# Altium project Wacky_Racers_Vehicle.PrjPcb
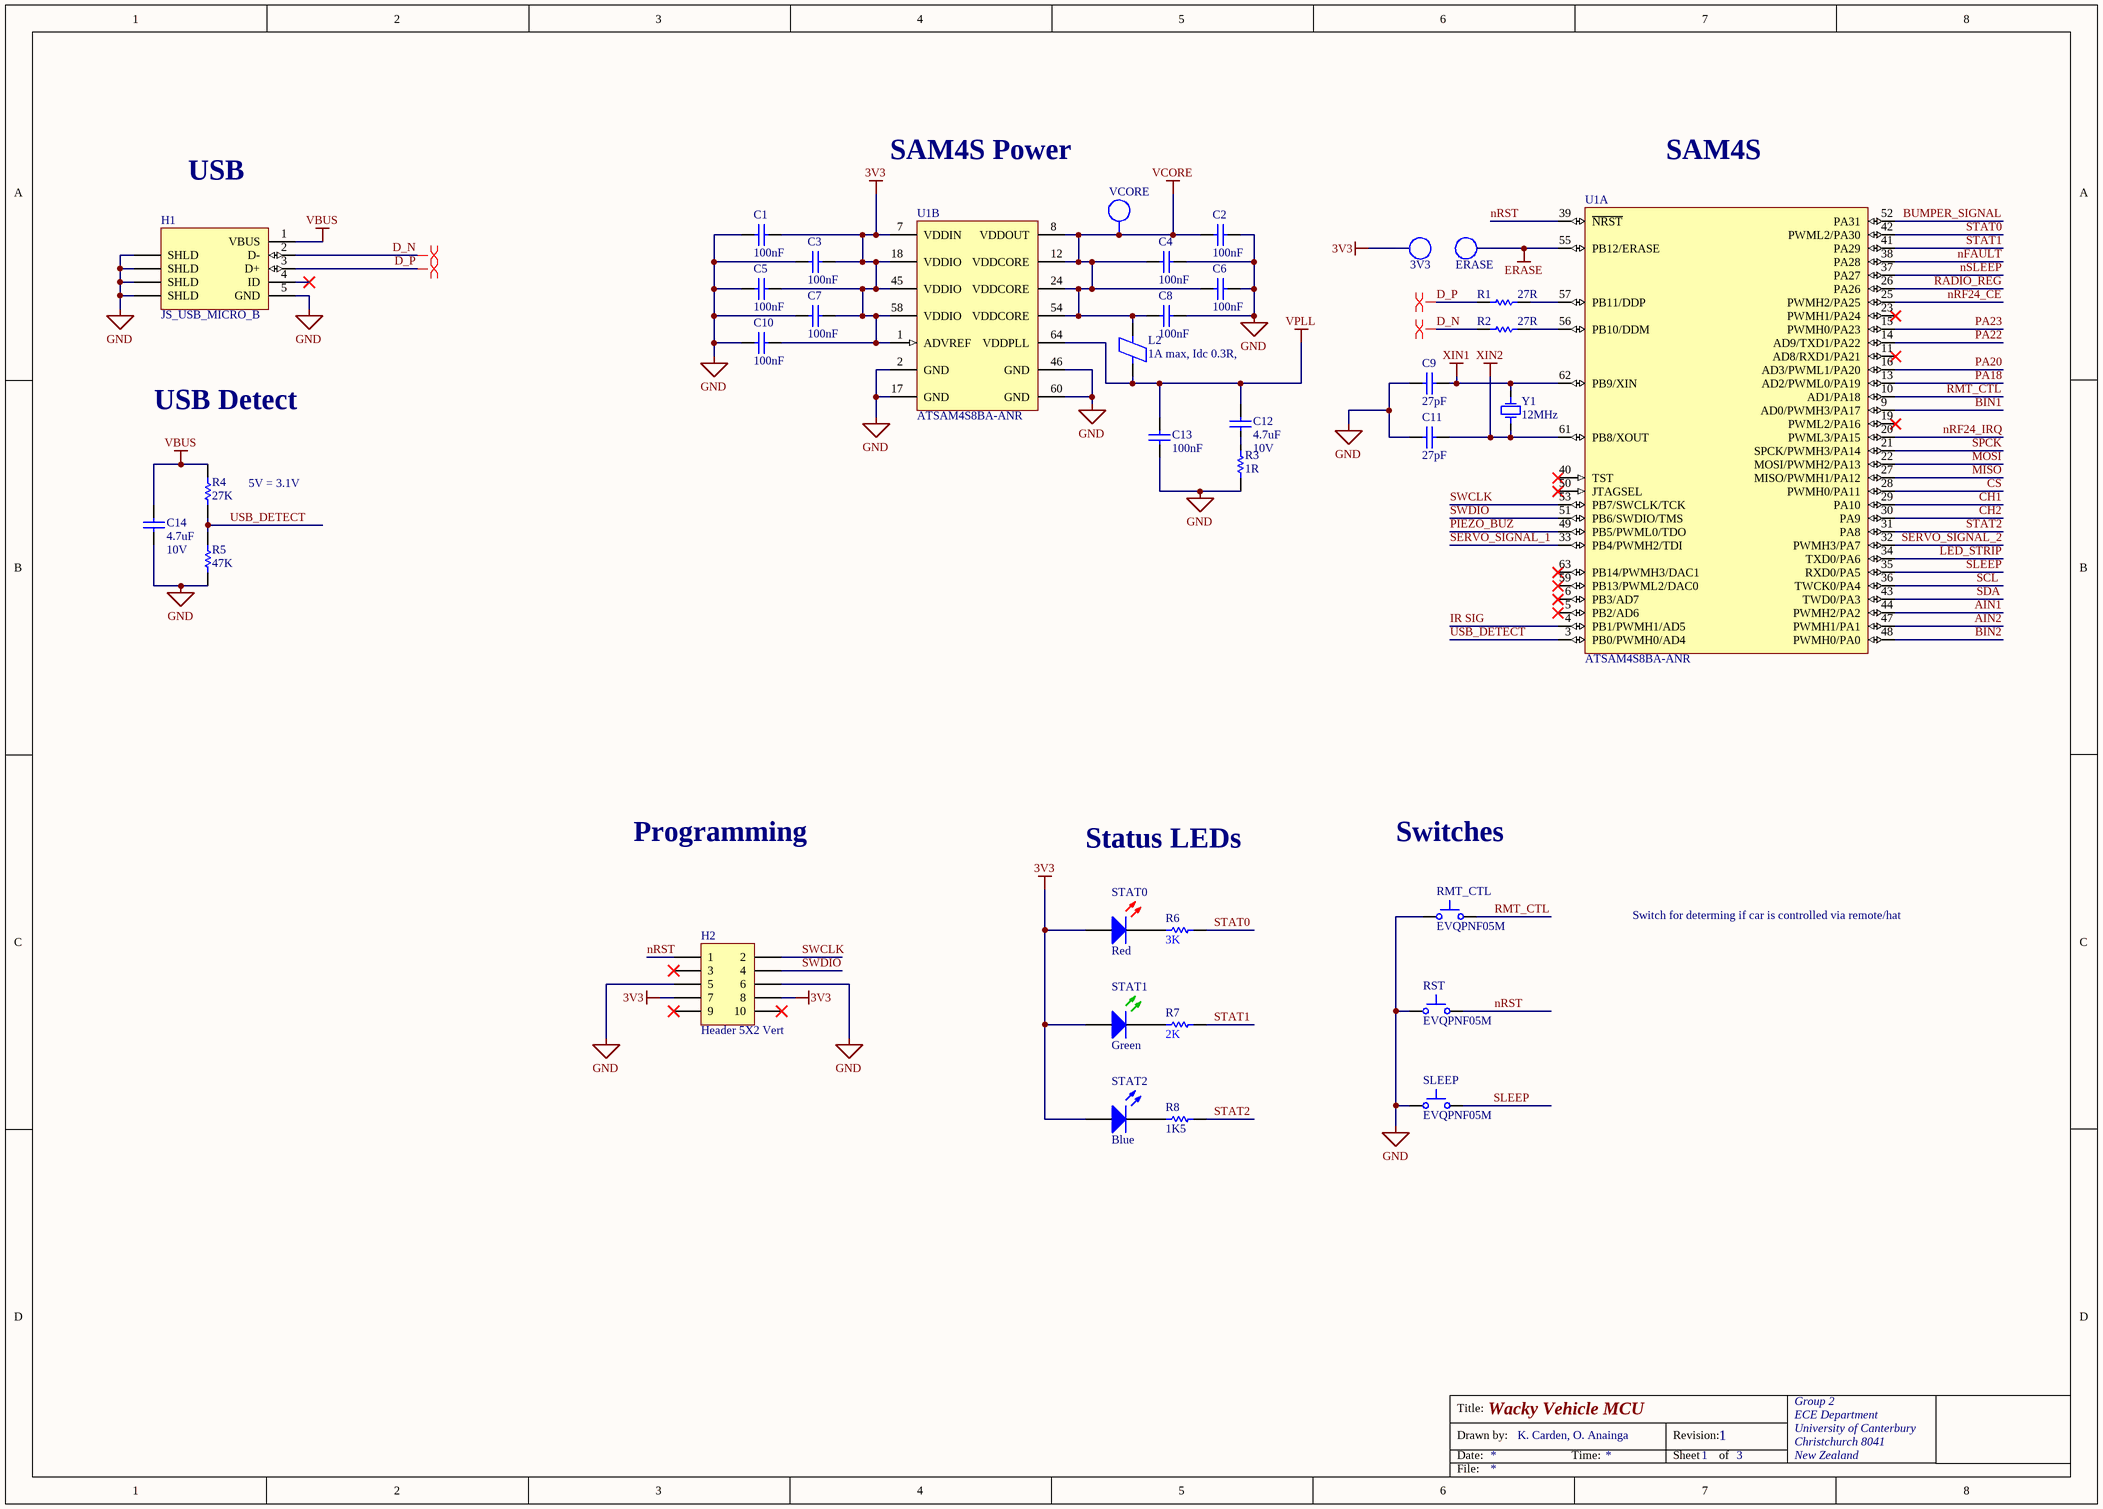
[diagram p0: Car_MCU.SchDoc]
3 sheets, 136 parts. Net scope: global (net labels, ports and power ports of the same name join across sheets).
Board file: Wacky_Car.PcbDoc
Sheets:
  Car_MCU.SchDoc
  Car_Peripherals.SchDoc
  Car_Power.SchDoc

## Sheet Car_MCU.SchDoc: Wacky Vehicle MCU
size A3; DrawnBy: K. Carden, O. Anainga; Organization: Group 2; Address1: ECE Department; Address2: University of Canterbury; Address3: Christchurch 8041; Address4: New Zealand; Revision: 1; SheetNumber: 1; SheetTotal: 3; ImagePath: C:\Users\Public\Documents\Altium\AD23\Templates\UC_Templates\uc-logo.png

### Parts
(Parts that share a designator on the sheet are numbered #1, #2 ... from top to bottom, then left to right.)
3V3#1  TP_0805  [TP_0805]  (value not drawn)
C1#1  100nF  [CAPC1608L]
C2#1  100nF  [CAPC1608L]
C3#1  100nF  [CAPC1608L]
C4#1  100nF  [CAPC1608L]
C5#1  100nF  [CAPC1608L]
C6#1  100nF  [CAPC1608L]
C7#1  100nF  [CAPC1608L]
C8#1  100nF  [CAPC1608L]
C9#1  27pF  [CAPC1608L]
C10#1  100nF  [CAPC1608L]
C11#1  27pF  [CAPC1608L]
C12#1  Max Voltage: 10V  [CAPC1608N]  (hidden comment: 4.7uF)
C13#1  100nF  [CAPC1608L]
C14#1  Max Voltage: 10V  [CAPC1608N]  (hidden comment: 4.7uF)
ERASE  TP_0805  [TP_0805]  (value not drawn)
H1  JS_USB_MICRO_B  [FCI_USB_10118194-0001LF]
H2  Header 5X2 Vert  [IDC2.54-V10D]
L2  1A max, Idc 0.3R,  [INDC3216L]
R1#1  27R  [RESC1608L]
R2#1  27R  [RESC1608L]
R3#1  1R  [RESC3216L]
R4#1  27K  [RESC1608L]
R5#1  47K  [RESC1608L]
R6  3K  [RESC1608L]
R7  2K  [RESC1608L]
R8  1K5  [RESC1608L]
RMT_CTL  EVQPNF05M  [EVQPNF05M]
RST  EVQPNF05M  [EVQPNF05M]
SLEEP  EVQPNF05M  [EVQPNF05M]
STAT0  Red  [WL-SMCW0603]
STAT1  Green  [WL-SMCW0603]
STAT2  Blue  [WL-SMCW0603]
U1#1  ATSAM4S8BA-ANR  [LQFP64_L]  (parts A,B of 2)
VCORE  VCORE  [TP_1206]  (value not drawn)  (no BOM)
Y1  12MHz  [6.0X3.5-4]

### Nets
3V3: 3V3#1.1(TP) C1#1.2 C3#1.2 C5#1.2 C7#1.2 C10#1.2 H2.7 H2.8 STAT0.2(A) STAT1.2(A) STAT2.2(A) U1#1.1(ADVREF) U1#1.7(VDDIN) U1#1.18(VDDIO) U1#1.45(VDDIO) U1#1.58(VDDIO)
ERASE: ERASE.1(TP) U1#1.55(PB12/ERASE)
GND: C1#1.1 C2#1.2 C3#1.1 C4#1.2 C5#1.1 C6#1.2 C7#1.1 C8#1.2 C9#1.1 C10#1.1 C11#1.1 C13#1.1 C14#1.1 H1.5(GND) H1.6(SHLD) H2.5 H2.6 R3#1.1 R5#1.1 RMT_CTL.1 RST.1 SLEEP.1 U1#1.2(GND) U1#1.17(GND) U1#1.46(GND) U1#1.60(GND)
VBUS: C14#1.2 H1.1(VBUS) R4#1.2
VCORE: C2#1.1 C4#1.1 C6#1.1 C8#1.1 L2.2 U1#1.8(VDDOUT) U1#1.12(VDDCORE) U1#1.24(VDDCORE) U1#1.54(VDDCORE) VCORE.1
VPLL: C12#1.2 C13#1.2 L2.1 U1#1.64(VDDPLL)
XIN1: C9#1.2 U1#1.62(PB9/XIN) Y1.3(OSC2)
XIN2: C11#1.2 U1#1.61(PB8/XOUT) Y1.1(OSC1)
AIN1: U1#1.44(PWMH2/PA2)
AIN2: U1#1.47(PWMH1/PA1)
BIN1: U1#1.9(AD0/PWMH3/PA17)
BIN2: U1#1.48(PWMH0/PA0)
BUMPER_SIGNAL: U1#1.52(PA31)
CH1: U1#1.29(PA10)
CH2: U1#1.30(PA9)
CS: U1#1.28(PWMH0/PA11)
D_N: H1.2(D-) R2#1.1
D_P: H1.3(D+) R1#1.1
IR SIG: U1#1.4(PB1/PWMH1/AD5)
LED_STRIP: U1#1.34(TXD0/PA6)
MISO: U1#1.27(MISO/PWMH1/PA12)
MOSI: U1#1.22(MOSI/PWMH2/PA13)
nFAULT: U1#1.38(PA28)
nRF24_CE: U1#1.25(PWMH2/PA25)
nRF24_IRQ: U1#1.20(PWML3/PA15)
nRST: H2.1 RST.2 U1#1.39(~{NRST})
nSLEEP: U1#1.37(PA27)
PA18: U1#1.13(AD2/PWML0/PA19)
PA20: U1#1.16(AD3/PWML1/PA20)
PA22: U1#1.14(AD9/TXD1/PA22)
PA23: U1#1.15(PWMH0/PA23)
PIEZO_BUZ: U1#1.49(PB5/PWML0/TDO)
RADIO_REG: U1#1.26(PA26)
RMT_CTL: RMT_CTL.2 U1#1.10(AD1/PA18)
SCL: U1#1.36(TWCK0/PA4)
SDA: U1#1.43(TWD0/PA3)
SERVO_SIGNAL_1: U1#1.33(PB4/PWMH2/TDI)
SERVO_SIGNAL_2: U1#1.32(PWMH3/PA7)
SLEEP: SLEEP.2 U1#1.35(RXD0/PA5)
SPCK: U1#1.21(SPCK/PWMH3/PA14)
STAT0: R6.2 U1#1.42(PWML2/PA30)
STAT1: R7.2 U1#1.41(PA29)
STAT2: R8.2 U1#1.31(PA8)
SWCLK: H2.2 U1#1.53(PB7/SWCLK/TCK)
SWDIO: H2.4 U1#1.51(PB6/SWDIO/TMS)
USB_DETECT: R4#1.1 R5#1.2 U1#1.3(PB0/PWMH0/AD4)
NetC12#1_1: C12#1.1 R3#1.2
NetR1#1_2: R1#1.2 U1#1.57(PB11/DDP)
NetR2#1_2: R2#1.2 U1#1.56(PB10/DDM)
NetR6_1: R6.1 STAT0.1(K)
NetR7_1: R7.1 STAT1.1(K)
NetR8_1: R8.1 STAT2.1(K)

Not connected (* = marked no-connect by the designer): H1 4(ID)*; H2 3* 9* 10*; U1#1 5(PB2/AD6)* 6(PB3/AD7)* 11(AD8/RXD1/PA21)* 19(PWML2/PA16)* 23(PWMH1/PA24)* 40(TST)* 50(JTAGSEL)* 59(PB13/PWML2/DAC0)* 63(PB14/PWMH3/DAC1)*

### Layout directives
differential pair: D_N, D_P

### Notes on the sheet
- USB
- SAM4S Power
- SAM4S
- USB Detect
- (near R4#1) 5V = 3.1V
- Programming
- Status LEDs
- Switches
- Switch for determing if car is controlled via remote/hat
- Title:
- Drawn by:
- Date:
- Time:
- Revision:
- Sheet
- of
- File:

### Library data of the parts
3V3#1 ERASE = TP_0805: Test Point 2.0X0.9X1.2mm SMD; Manufacturer: TE Connectivity AMP Connectors; Manufacturer Part Number: 1625854-2; Supplier 1: Digi-Key; Mounting Type: Surface Mount; Terminal: 0.079" x 0.049" x 0.057" (2.00mm x 1.25mm x 1.45mm); Type: PC Test Point; Supplier Part Number 1: A106144CT-ND
C1#1 C2#1 C3#1 C4#1 C5#1 C6#1 C7#1 C8#1 C10#1 C13#1 = CC_100nF_0603: CAP CER 100nF X7R +-10% 50V 0603; PackageReference: 0603; Code_IPC: 1608 [0603]; Verify: *; Supplier: ECE Dept; Storage Location: PCB Assembly WS; Value: 100nF
C9#1 C11#1 = CC_27pF_0603: CAP CER 27pF NPO/COG +-5% 50V 0603; PackageReference: 0603; Code_IPC: 1608 [0603]; Verify: *; Supplier: ECE Dept; Storage Location: PCB Assembly WS; Value: 27pF
C12#1 C14#1 = CC_4.7uF_0603: CAP CER 4.7uF X5R +-20%  10V 0603; Note: Footprint corresponds to dimensions for bulk cassette packaging. This case size has tightened tolerances.; PackageReference: 0805; Code_IPC: 2012[0805]; Verify: *; Supplier: ECE Dept; Storage Location: PCB Assembly WS; Value: 4.7uF
H1 = JS_USB_MICRO_B_SMT: CONN USB MICRO B RECPT SMT R/A; Manufacturer: FCI; Manufacturer Part Number: 10118194-0001LF; Gender: Receptacle; Number of Contacts: 5; Specifications: USB 2.0; Supplier 1: Digi-Key; Supplier Part Number 1: 609-4618-1-ND; Features: Shielded, Solder Retention; Mounting Type: Surface Mount, Right Angle, Horizontal
H2 = JA_HDR_IDC_5X2_VERT: IDC Header, 2,54mm, 10-Pin, Vert; Supplier: ECE Dept; Supplier 1: Farnell; Supplier Part Number 1: 1096985; Storage Location: ECE Dept Store
L2 = IN_Ferrite-Bead: Ferrite Bead, Rdc 0.3R, Z100MHZ 600R, Imax 1A, SMD 1206; Manufacturer: FAIR-RITE; Manufacturer PN: 2512066017Y1; DC Current Rating: 1; DC Resistance Max: 0.08; Ferrite Case Style: 1206 ^3216 Metric]; Frequency Range: 50MHz to 1; Impedance: 600; Impedance Tolerance: ± 25%; Supplier: ECE Dept; Storage Location: PCB Assembly WS; Ferrite Mounting: SMD; Supplier 1: Farnell; Supplier Part Number 1: 1612060; Manufacturer Part Number: 2512066017Y1; Value: 1A max, Idc 0.3R,
R1#1 R2#1 = RS_27R: RES 27 OHM 1/10W 5% 0603 SMD; Storage Location: PCB Assembly WS; Supplier: ECE Dept; Value: 27R
R3#1 = RT_1R: RES 1R OHM 1/4W 5% 1206 SMD; Storage Location: PCB Assembly WS; Supplier: ECE Dept; Value: 1R
R4#1 = RS_27K: RES 27K OHM 1/10W 5% 0603 SMD; Storage Location: PCB Assembly WS; Supplier: ECE Dept; Value: 27K
R5#1 = RS_47K: RES 47.0K OHM 1/10W 5% 0603 SMD; Storage Location: PCB Assembly WS; Supplier: ECE Dept; Value: 47K
R6 = RS_3K: RES 3K OHM 1/10W 5% 0603 SMD; Storage Location: PCB Assembly WS; Supplier: ECE Dept; Value: 3K
R7 = RS_2K: RES 2K OHM 1/10W 5% 0603 SMD; Storage Location: PCB Assembly WS; Supplier: ECE Dept; Value: 2K
R8 = RS_1K5: RES 1.5K OHM 1/10W 5% 0603 SMD; Storage Location: PCB Assembly WS; Supplier: ECE Dept; Value: 1K5
RMT_CTL RST SLEEP = WS_EVQPNF05M: Panasonic 6 x 3.5mm SMD Light Touch Switch Type SMD; PackageDescription: 6.0 x 3.5 mm; Supplier 1: Farnell; Supplier Part Number 1: 2079481; Manufacturer: Panasonic; Manufacturer PN: EVQPNF05M; Supplier 2: Digi-Key; Supplier Part Number 2: P13598SCT-ND; Storage Location: PCB Assembly WS; Supplier: ECE Dept
STAT0 = DL_150060RS75000: LED Red 250mcd 0603 SMD; Manufacturer: WURTH ELEKTRONIK; Forward Current If: 30; Forward Voltage: 2; Lens Shape: Rectangular; Luminous Intensity: 250; Wavelength Typ: 625; Viewing Angle: 140°; LED Mounting: SMD; Supplier 1: Farnell; Supplier Part Number 1: 2322071; Manufacturer Part Number: 150060RS75000; Storage Location: PCB Assembly WS; Supplier: ECE Dept; LED Colour: Red
STAT1 = DL_150060GS75000: LED Green 430mcd 0603 SMD; Manufacturer: WURTH ELEKTRONIK; Forward Current If: 30; Wavelength Typ: 520; Forward Voltage: 3.2; Lens Shape: Rectangular; Luminous Intensity: 430; Viewing Angle: 140°; LED Mounting: SMD; Supplier 1: Farnell; Supplier Part Number 1: 2322070; Manufacturer Part Number: 150060GS75000; Storage Location: PCB Assembly WS; Supplier: ECE Dept; LED Colour: Green
STAT2 = DL_150060BS75000: LED Blue 270mcd 0603 SMD; Manufacturer: WURTH ELEKTRONIK; Forward Current If: 30; Forward Voltage: 3.2; Luminous Intensity: 270; Viewing Angle: 120°; Wavelength Typ: 470; Pricing: 1=0.3844, 50=0.3252, 100=0.2957, 500=0.2365 (NZD); Supplier 1: Farnell; Supplier Part Number 1: 2322069; Manufacturer Part Number: 150060BS75000; Storage Location: PCB Assembly WS; Supplier: ECE Dept; LED Colour: Blue
U1#1 = SE_ATSAM4S16BA-MU: IC MCU 32BIT 512KB FLASH 64LQFP; Manufacturer: Atmel; Connectivity: I²C, IrDA, Memory Card, SPI, SSC, UART/USART, USB; Core Processor: ARM® Cortex®-M4; Core Size: 32-Bit; Data Converters: A/D 11x12b, D/A 2x12b; Number of I/O: 47; Peripherals: Brown-out Detect/Reset, DMA, POR, PWM, WDT; Program Memory Size: 512KB (512K x 8); RAM Size: 128K x 8; Speed: 120MHz; Voltage - Supply (Vcc/Vdd): 1.62 V ~ 3.6 V; PackageVersion: revJ, Jul-2007; PackageReference: 64PS; PackageDescription: 64-Pin Quad Flat No-Lead (QFN) Sawn, 9 x 9 x 1.0 mm Body, 0.5 mm Pitch, Exposed Pad; Code_JEDEC: MO-220VMMD-3; ComponentLink1Description: Manufacturer URL; ComponentLink1URL: http://www.atmel.com/; ComponentLink2Description: SAM4S Series Datasheet; ComponentLink2URL: http://www.atmel.com/dyn/resources/prod_documents/11100.pdf; ComponentLink3Description: SAM4S Series Summary; ComponentLink3URL: http://www.atmel.com/dyn/resources/prod_documents/11100S.pdf; Supplier 1: Digi-Key; Package / Case: 64-LQFP; Packaging: Cut Tape (CT); Program Memory Type: FLASH; Supplier Part Number 1: ATSAM4S8BA-ANRCT-ND; Manufacturer Part Number: ATSAM4S8BA-ANR
VCORE = TP_1206: Test-Point 3.3x1.6x2.1mm SMD; Manufacturer: Harwin Inc; Manufacturer Part Number: S1751-46R; Value: TP; Manufacturer PN: *; Storage Location: ProtoPlace; Mounting Type: Surface Mount; Type: PC Test Point; Supplier 1: Digi-Key; Supplier Part Number 1: 952-1478-2-ND; Supplier 2: Farnell; Supplier Part Number 2: 1826282; Supplier: ECE Dept
Y1 = XT_CRYSTAL_12MHz_18pF: CRYSTAL 12MHZ 18PF 6X3.5mm SMD; Manufacturer: CTS-Frequency Controls; Manufacturer Part Number: 406C35D12M00000; ESR (Equivalent Series Resistance): 60 Ohm; Frequency Stability: ±50ppm; Frequency Tolerance: ±30ppm; Operating Mode: Fundamental; Supplier 1: Digi-Key; Height: 0.047" (1.20mm); Load Capacitance: 18pF; Mounting Type: Surface Mount; Operating Temperature: -20°C ~ 70°C; Package / Case: 4-SMD, No Lead (DFN, LCC); Size / Dimension: 0.236" L x 0.138" W (6.00mm x 3.50mm); Supplier Part Number 1: CTX855CT-ND; Frequency: 12MHz

## Sheet Car_Peripherals.SchDoc: Wacky Vehicle Peripherals
size A3; DrawnBy: K. Carden, O. Anainga; Organization: Group 2; Address1: ECE Department; Address2: University of Canterbury; Address3: Christchurch 8041; Address4: New Zealand; Revision: 1; SheetNumber: 2; SheetTotal: 3; ImagePath: C:\Users\Public\Documents\Altium\AD23\Templates\UC_Templates\uc-logo.png
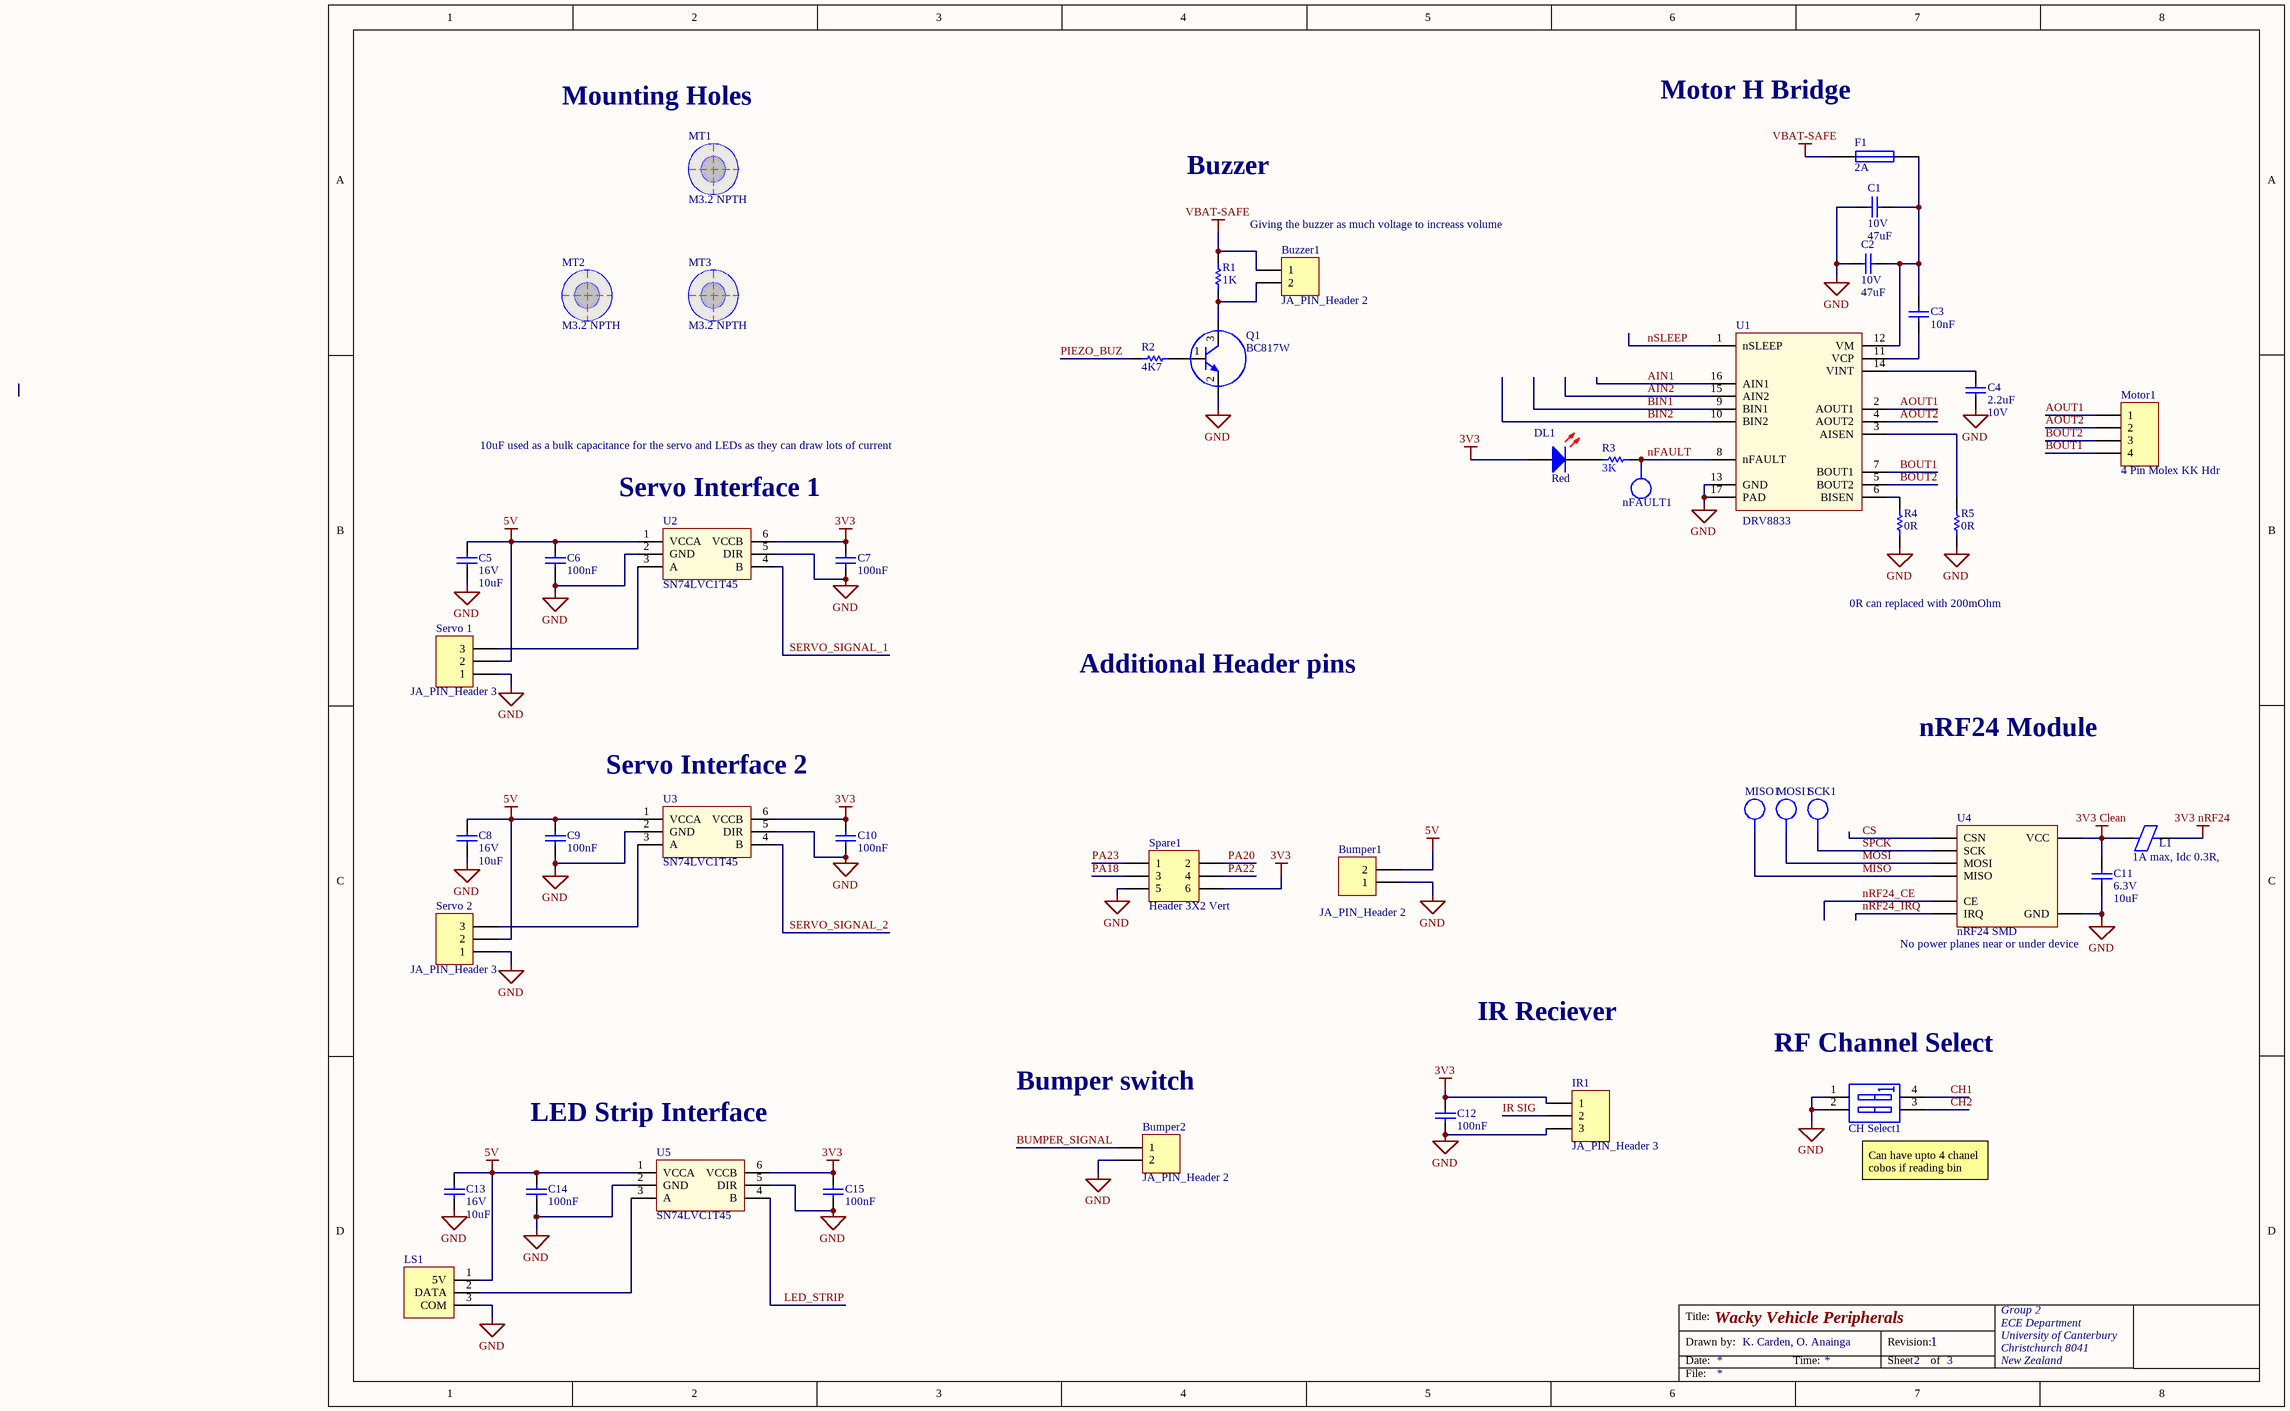
[diagram p1: Car_Peripherals.SchDoc]

### Parts
(Parts that share a designator on the sheet are numbered #1, #2 ... from top to bottom, then left to right.)
Bumper1  JA_PIN_Header 2  [HDR1X2]
Bumper2  JA_PIN_Header 2  [HDR1X2]
Buzzer1  JA_PIN_Header 2  [HDR1X2]
C1#2  Max Voltage: 10V  [CAPC3216L]  (hidden comment: 47uF)
C2#2  Max Voltage: 10V  [CAPC3216L]  (hidden comment: 47uF)
C3#2  10nF  [CAPC1608L]
C4#2  Max Voltage: 10V  [CAPC1608L]  (hidden comment: 2.2uF)
C5#2  Voltage - Rated: 16V  [CAPC2012L]  (hidden comment: 10uF)
C6#2  100nF  [CAPC1608L]
C7#2  100nF  [CAPC1608L]
C8#2  Voltage - Rated: 16V  [CAPC2012L]  (hidden comment: 10uF)
C9#2  100nF  [CAPC1608L]
C10#2  100nF  [CAPC1608L]
C11#2  Voltage - Rated: 6.3V  [CAPC1608L]  (hidden comment: 10uF)
C12#2  100nF  [CAPC1608L]
C13#2  Voltage - Rated: 16V  [CAPC2012L]  (hidden comment: 10uF)
C14#2  100nF  [CAPC1608L]
C15  100nF  [CAPC1608L]
CH_Select1  WS_SW DIP-2  [DIP_SW_2WAY_SMD]  (value not drawn)
DL1  Red  [WL-SMCW0603]
F1  2A  [RESC3216N]
IR1  JA_PIN_Header 3  [HDR1X3]
L1  1A max, Idc 0.3R,  [INDC3216L]
LS1  3 Pin Molex KK Hdr  [MOLEX_KK_3_HDR]  (value not drawn)
MISO1  (no value)  [TP_1206]  (no BOM)
MOSI1  (no value)  [TP_1206]  (no BOM)
Motor1  4 Pin Molex KK Hdr  [MOLEX_KK_4_HDR]
MT1  M3.2 NPTH  [MNT-HOLE_3.2mm_NPTH]  (no BOM)
MT2  M3.2 NPTH  [MNT-HOLE_3.2mm_NPTH]  (no BOM)
MT3  M3.2 NPTH  [MNT-HOLE_3.2mm_NPTH]  (no BOM)
nFAULT1  (no value)  [TP_1206]  (no BOM)
Q1  BC817W  [SOT323_M]
R1#2  1K  [RESC1608L]
R2#2  4K7  [RESC1608L]
R3#2  3K  [RESC1608L]
R4#2  0R  [RESC3216L]
R5#2  0R  [RESC3216L]
SCK1  (no value)  [TP_1206]  (no BOM)
Servo_1  JA_PIN_Header 3  [HDR1X3]
Servo_2  JA_PIN_Header 3  [HDR1X3]
Spare1  Header 3X2 Vert  [IDC2.54-V06D]
U1#2  DRV8833  [HTSOP16 DRV8833]
U2  SN74LVC1T45  [SOT23-6_N]
U3  SN74LVC1T45  [SOT23-6_N]
U4  nRF24 SMD  Warning: No power planes near or under device  [NRF24]
U5  SN74LVC1T45  [SOT23-6_N]

### Nets
3V3: C7#2.2 C10#2.2 C12#2.2 C15.2 DL1.2(A) IR1.1 Spare1.6 U2.6(VCCB) U3.6(VCCB) U5.6(VCCB)
3V3 Clean: C11#2.2 L1.2 U4.1(VCC)
3V3 nRF24: L1.1
5V: Bumper1.2 C5#2.2 C6#2.2 C8#2.2 C9#2.2 C13#2.2 C14#2.2 LS1.1(5V) Servo_1.2 Servo_2.2 U2.1(VCCA) U3.1(VCCA) U5.1(VCCA)
GND: Bumper1.1 Bumper2.2 C1#2.2 C2#2.2 C4#2.1 C5#2.1 C6#2.1 C7#2.1 C8#2.1 C9#2.1 C10#2.1 C11#2.1 C12#2.1 C13#2.1 C14#2.1 C15.1 CH_Select1.1(A1) CH_Select1.2(A2) IR1.3 LS1.3(COM) Q1.2 R4#2.1 R5#2.1 Servo_1.1 Servo_2.1 Spare1.5 U1#2.13(GND) U1#2.17(PAD) U2.2(GND) U2.5(DIR) U3.2(GND) U3.5(DIR) U4.2(GND) U5.2(GND) U5.5(DIR)
VBAT-SAFE: Buzzer1.1 F1.1 R1#2.2
AIN1: U1#2.16(AIN1)
AIN2: U1#2.15(AIN2)
AOUT1: Motor1.1 U1#2.2(AOUT1)
AOUT2: Motor1.2 U1#2.4(AOUT2)
BIN1: U1#2.9(BIN1)
BIN2: U1#2.10(BIN2)
BOUT1: Motor1.4 U1#2.7(BOUT1)
BOUT2: Motor1.3 U1#2.5(BOUT2)
BUMPER_SIGNAL: Bumper2.1
CH1: CH_Select1.4(B1)
CH2: CH_Select1.3(B2)
CS: U4.4(CSN)
IR SIG: IR1.2
LED_STRIP: U5.4(B)
MISO: MISO1.1 U4.7(MISO)
MOSI: MOSI1.1 U4.6(MOSI)
nFAULT: nFAULT1.1 R3#2.2 U1#2.8(nFAULT)
nRF24_CE: U4.3(CE)
nRF24_IRQ: U4.8(IRQ)
nSLEEP: U1#2.1(nSLEEP)
PA18: Spare1.3
PA20: Spare1.2
PA22: Spare1.4
PA23: Spare1.1
PIEZO_BUZ: R2#2.1
SERVO_SIGNAL_1: U2.4(B)
SERVO_SIGNAL_2: U3.4(B)
SPCK: SCK1.1 U4.5(SCK)
NetBuzzer1_2: Buzzer1.2 Q1.3 R1#2.1
NetC1#2_1: C1#2.1 C2#2.1 C3#2.2 F1.2 U1#2.12(VM)
NetC3#2_1: C3#2.1 U1#2.11(VCP)
NetC4#2_2: C4#2.2 U1#2.14(VINT)
NetDL1_1: DL1.1(K) R3#2.1
NetLS1_2: LS1.2(DATA) U5.3(A)
NetQ1_1: Q1.1 R2#2.2
NetR4#2_2: R4#2.2 U1#2.6(BISEN)
NetR5#2_2: R5#2.2 U1#2.3(AISEN)
NetServo_1_3: Servo_1.3 U2.3(A)
NetServo_2_3: Servo_2.3 U3.3(A)

### Notes on the sheet
- Motor H Bridge
- Mounting Holes
- Buzzer
- Giving the buzzer as much voltage to increass volume
- 10uF used as a bulk capacitance for the servo and LEDs as they can draw lots of current
- Servo Interface 1
- 0R can replaced with 200mOhm
- Additional Header pins
- Servo Interface 2
- nRF24 Module
- IR Reciever
- (near CH_Select1) RF Channel Select
- Bumper switch
- LED Strip Interface
- (near CH_Select1) Can have upto 4 chanel cobos if reading bin
- Title:
- Drawn by:
- Date:
- Time:
- Revision:
- Sheet
- of
- File:

### Library data of the parts
Bumper1 Bumper2 Buzzer1 = JA_PIN_Header 2: Header, 2-Pin; LatestRevisionDate: 17-Jul-2002; LatestRevisionNote: Re-released for DXP Platform.; Publisher: Altium Limited
C1#2 C2#2 = CC_47uF_1206: CAP CER 47uF X5R -/+20% 10V 1206; Verify: *; Supplier: ECE Dept; Storage Location: PCB Assembly WS; Dielectric: X5R; Footprint: 1210 (3225 metric); MoV: 10V; Value: 47uF
C3#2 = CC_10nF_0603: CAP CER 10nF X7R +-10% 50V 0603; PackageReference: 0603; Code_IPC: 1608 [0603]; Verify: *; Supplier: ECE Dept; Storage Location: PCB Assembly WS; Value: 10nF
C4#2 = CC_2.2uF_0603: CAP CER 2.2uF X5R +-20% 10V 0603; PackageReference: 0603; Code_IPC: 1608 [0603]; Verify: *; Supplier: ECE Dept; Storage Location: PCB Assembly WS; Value: 2.2uF
C5#2 C8#2 C13#2 = CC_10uF_0805_16V: CAP CER 10uF X5R 16V 0805; Manufacturer: Samsung Electro-Mechanics; Manufacturer Part Number: CL21A106KOQNNWE; Note: Footprint corresponds to dimensions for bulk cassette packaging. This case size has tightened tolerances.; Tolerance: ±10%; Notification: Current market demand for these product types have resulted in fluctuating and extending lead times. Lead times may differ.; PackageReference: 0805; Code_IPC: 2012[0805]; Supplier 1: Digi-Key; RoHS: RoHS Compliant; Category: Capacitors; Stock 1: 20000; Pricing 1: 1=0.35, 10=0.25, 100=0.1178, 500=0.08254, 1000=0.06831 (NZD); Packaging: Cut Tape (CT); Part Status: Active; Temperature Coefficient: X5R; Operating Temperature: -55°C ~ 85°C; Features: -; Ratings: -; Applications: General Purpose; Mounting Type: Surface Mount, MLCC; Package / Case: 0805 (2012 Metric); Size / Dimension: 0.079" L x 0.049" W (2.00mm x 1.25mm); Height - Seated (Max): -; Thickness (Max): 0.055" (1.40mm); Lead Spacing: -; Lead Style: -; ComponentLink1URL: http://www.samsungsem.com/kr/support/product-search/mlcc/CL21A106KOQNNWE.jsp; ComponentLink1Description: http://www.samsungsem.com/kr/support/product-search/mlcc/CL21A106KOQNNWE.jsp; Supplier Part Number 1: 1276-2894-1-ND; Value: 10uF
C6#2 C7#2 C9#2 C10#2 C12#2 C14#2 C15 = CC_100nF_0603: CAP CER 100nF X7R +-10% 50V 0603; PackageReference: 0603; Code_IPC: 1608 [0603]; Verify: *; Supplier: ECE Dept; Storage Location: PCB Assembly WS; Value: 100nF
C11#2 = CC_10uF_0603: CAP CER 10UF X5R +-20% 6V3 0603; Supplier: ECE Dept; Storage Location: PCB Assembly WS; Value: 10uF
CH_Select1 = WS_SW DIP-2: DIP Switch, 2 Position, SPST SMD; Manufacturer: OMRON ELECTRONIC COMPONENTS; Manufacturer Part Number: A6SN-2101; Contact Current DC Max: 25; External Length / Height: 7; No. of Switch Positions: 2; Pitch Spacing: 2.54; PackageReference: DIP-4; Contact Configuration: SPST; Supplier 1: Farnell; Supplier Part Number 1: 2029424; Storage Location: PCB Assembly WS; Supplier: ECE Dept
DL1 = DL_150060RS75000: as STAT0 on sheet Car_MCU; LED Mounting: SMD; Supplier 1: Farnell; Supplier Part Number 1: 2322071; Manufacturer Part Number: 150060RS75000; Storage Location: PCB Assembly WS; Supplier: ECE Dept; LED Colour: Red
F1 = FS_Fuse_2.0A: Fuse 2.0A Very Fast Acting 1206 SMD; Manufacturer: MULTICOMP; Manufacturer PN: MC12CF 002; Supplier: ECE Dept; Storage Location: PCB Assembly WS; Supplier 1: Farnell; Supplier Part Number 1: 1841029; Manufacturer Part Number: MC12CF 002; Value: 2A
IR1 Servo_1 Servo_2 = JA_PIN_Header 3: Header, 3-Pin; LatestRevisionDate: 17-Jul-2002; LatestRevisionNote: Re-released for DXP Platform.; Publisher: Altium Limited
L1 = IN_Ferrite-Bead: as L2 on sheet Car_MCU; Supplier: ECE Dept; Storage Location: PCB Assembly WS; Ferrite Mounting: SMD; Supplier 1: Farnell; Supplier Part Number 1: 1612060; Manufacturer Part Number: 2512066017Y1; Value: 1A max, Idc 0.3R,
LS1 = LED_Strip_Header: CONN HEADER 3POS 2.54mm VERT_Thru Hole; Manufacturer: Molex; Manufacturer PN: 22-23-2031; Supplier Part Number 1: 9731156; Supplier: ECE Dept; Supplier 1: Farnell; Storage Location: ECE Dept Store; Value: 3 Pin Molex KK Hdr
MISO1 MOSI1 nFAULT1 SCK1 = TP_1206: as VCORE on sheet Car_MCU; Manufacturer PN: *; Storage Location: ProtoPlace; Mounting Type: Surface Mount; Type: PC Test Point; Supplier 1: Digi-Key; Supplier Part Number 1: 952-1478-2-ND; Supplier 2: Farnell; Supplier Part Number 2: 1826282; Supplier: ECE Dept
Motor1 = JA_MOLEX_KK_4POS: CONN HEADER 4POS 2.54mm VERT_Thru Hole; Manufacturer: Molex; Manufacturer PN: 22-23-2041; Supplier Part Number 1: 9731164; Supplier: ECE Dept; Supplier 1: Farnell; Storage Location: ECE Dept Store; Value: 4 Pin Molex KK Hdr
MT1-MT3 = MC_M3.2_HOLE: Fixing M3.2 Mount Hole NPTH; Manufacturer: Hi-Q; Manufacturer PN: 3BV series M3 Clearance; price: 0; Supplier: ECE Dept; value: M3.2 NPTH
Q1 = TB_BC817W: NPN GP Bipolar Transistor 45V 500mA SOT323; Manufacturer: NXP; Supplier 1: Farnell; Supplier Part Number 1: 2114873; Manufacturer PN: BC817W; Storage Location: PCB Assembly WS; Supplier: ECE Dept; Supplier 2: Digi-Key; Value: BC817W; Supplier Part Number 2: 1727-4843-1-ND
R1#2 = RS_1K: RES 1.0K OHM 1/10W 5% 0603 SMD; Storage Location: PCB Assembly WS; Supplier: ECE Dept; Value: 1K
R2#2 = RS_4K7: RES 4.7K OHM 1/10W 5% 0603 SMD; Storage Location: PCB Assembly WS; Supplier: ECE Dept; Value: 4K7
R3#2 = RS_3K: RES 3K OHM 1/10W 5% 0603 SMD; Storage Location: PCB Assembly WS; Supplier: ECE Dept; Value: 3K
R4#2 R5#2 = RT_0R: RES 0R OHM 1/8W 5% 1206 SMD; Storage Location: PCB Assembly WS; Supplier: ECE Dept; Value: 0R
Spare1 = JA_HDR_IDC_3X2_VERT: IDC Header, 2,54mm, 6-Pin, Vert; Manufacturer: Amphenol FCI; Manufacturer Part Number: 75869-131LF; Number of Positions: 6; Max Voltage Rating (AC): 500V; Connector Type: Male Pin; Current Rating: 3A; Gender: Male; Max Current Rating: 2A; Pitch: 2.54mm; Row Spacing: 0.1inch; Mating Post Length: 6mm; Supplier: ECE Dept; Storage Location: ECE Dept Store; Supplier 1: Digi-Key; Supplier 2: Element14; Stock 1: 21632; Pricing 1: 1=0.74, 10=0.697, 100=0.5345, 500=0.4648, 1000=0.38346, 5000=0.33698, 10000=0.31374 (USD); Mount: Through Hole; Contact Plating: Gold,GXT; Contact Material: Bronze,Copper Alloy; Colour: Blue; Housing Colour: Blue; Housing Material: Thermoplastic; Min Operating Temperature: -65°C; Max Operating Temperature: 125°C; Number of Rows: 2; Packaging: Rail/Tube; Package Quantity: 100; Termination: Solder; Number of Contacts: 6; Orientation: Straight; Contact Gender: Male; Voltage Rating: 500V; Length: 14.83mm; Height: 27.2mm; Depth: 9.55mm; Termination Post Length: 3.05mm; Contact Mating Length: 0.236inch; Radiation Hardening: No; Lead Free: Lead Free; REACH SVHC: No SVHC; ComponentLink1URL: https://datasheet.ciiva.com/16656/75869-16656678.pdf; ComponentLink1Description: https://datasheet.ciiva.com/16656/75869-16656678.pdf; ComponentLink2URL: https://datasheet.ciiva.com/5722/75869-5722919.pdf; ComponentLink2Description: https://datasheet.ciiva.com/5722/75869-5722919.pdf; ComponentLink3URL: https://datasheet.ciiva.com/9465/75869-9465975.pdf; ComponentLink3Description: https://datasheet.ciiva.com/9465/75869-9465975.pdf; ComponentLink4URL: https://datasheet.ciiva.com/11748/0900766b80d79252-11748151.pdf; ComponentLink4Description: https://datasheet.ciiva.com/11748/0900766b80d79252-11748151.pdf; ComponentLink5URL: https://datasheet.ciiva.com/719/75869-719692.pdf; ComponentLink5Description: https://datasheet.ciiva.com/719/75869-719692.pdf; ComponentLink6URL: https://datasheet.ciiva.com/8046/75869-8046653.pdf; ComponentLink6Description: https://datasheet.ciiva.com/8046/75869-8046653.pdf; ComponentLink7URL: https://datasheet.ciiva.com/22644/1688107-22644798.pdf; ComponentLink7Description: https://datasheet.ciiva.com/22644/1688107-22644798.pdf; Supplier Part Number 1: 609-2845-ND; Supplier Part Number 2: 2293757
U1#2 = DRV8833: Dual H-Bridge Motor Driver 1.5A; ComponentLink1Description: DRV8833 Datasheet; ComponentLink1URL: \\maxwell\elecapp\AltiumDesigner\Libraries\DatasheetsNew\ENCE461\drv8833pwpr.pdf
U2 U3 U5 = SN74LVC1T45: 1.8V - 5V level converter
U4 = NRF24: nRF24 SMD Module

## Sheet Car_Power.SchDoc: Wacky Vehicle Power
size A3; DrawnBy: K. Carden, O. Anainga, Liam May; Organization: Group 2; Address1: ECE Department; Address2: University of Canterbury; Address3: Christchurch 8041; Address4: New Zealand; Revision: 1; SheetNumber: 3; SheetTotal: 3; ImagePath: C:\Users\Public\Documents\Altium\AD23\Templates\UC_Templates\uc-logo.png
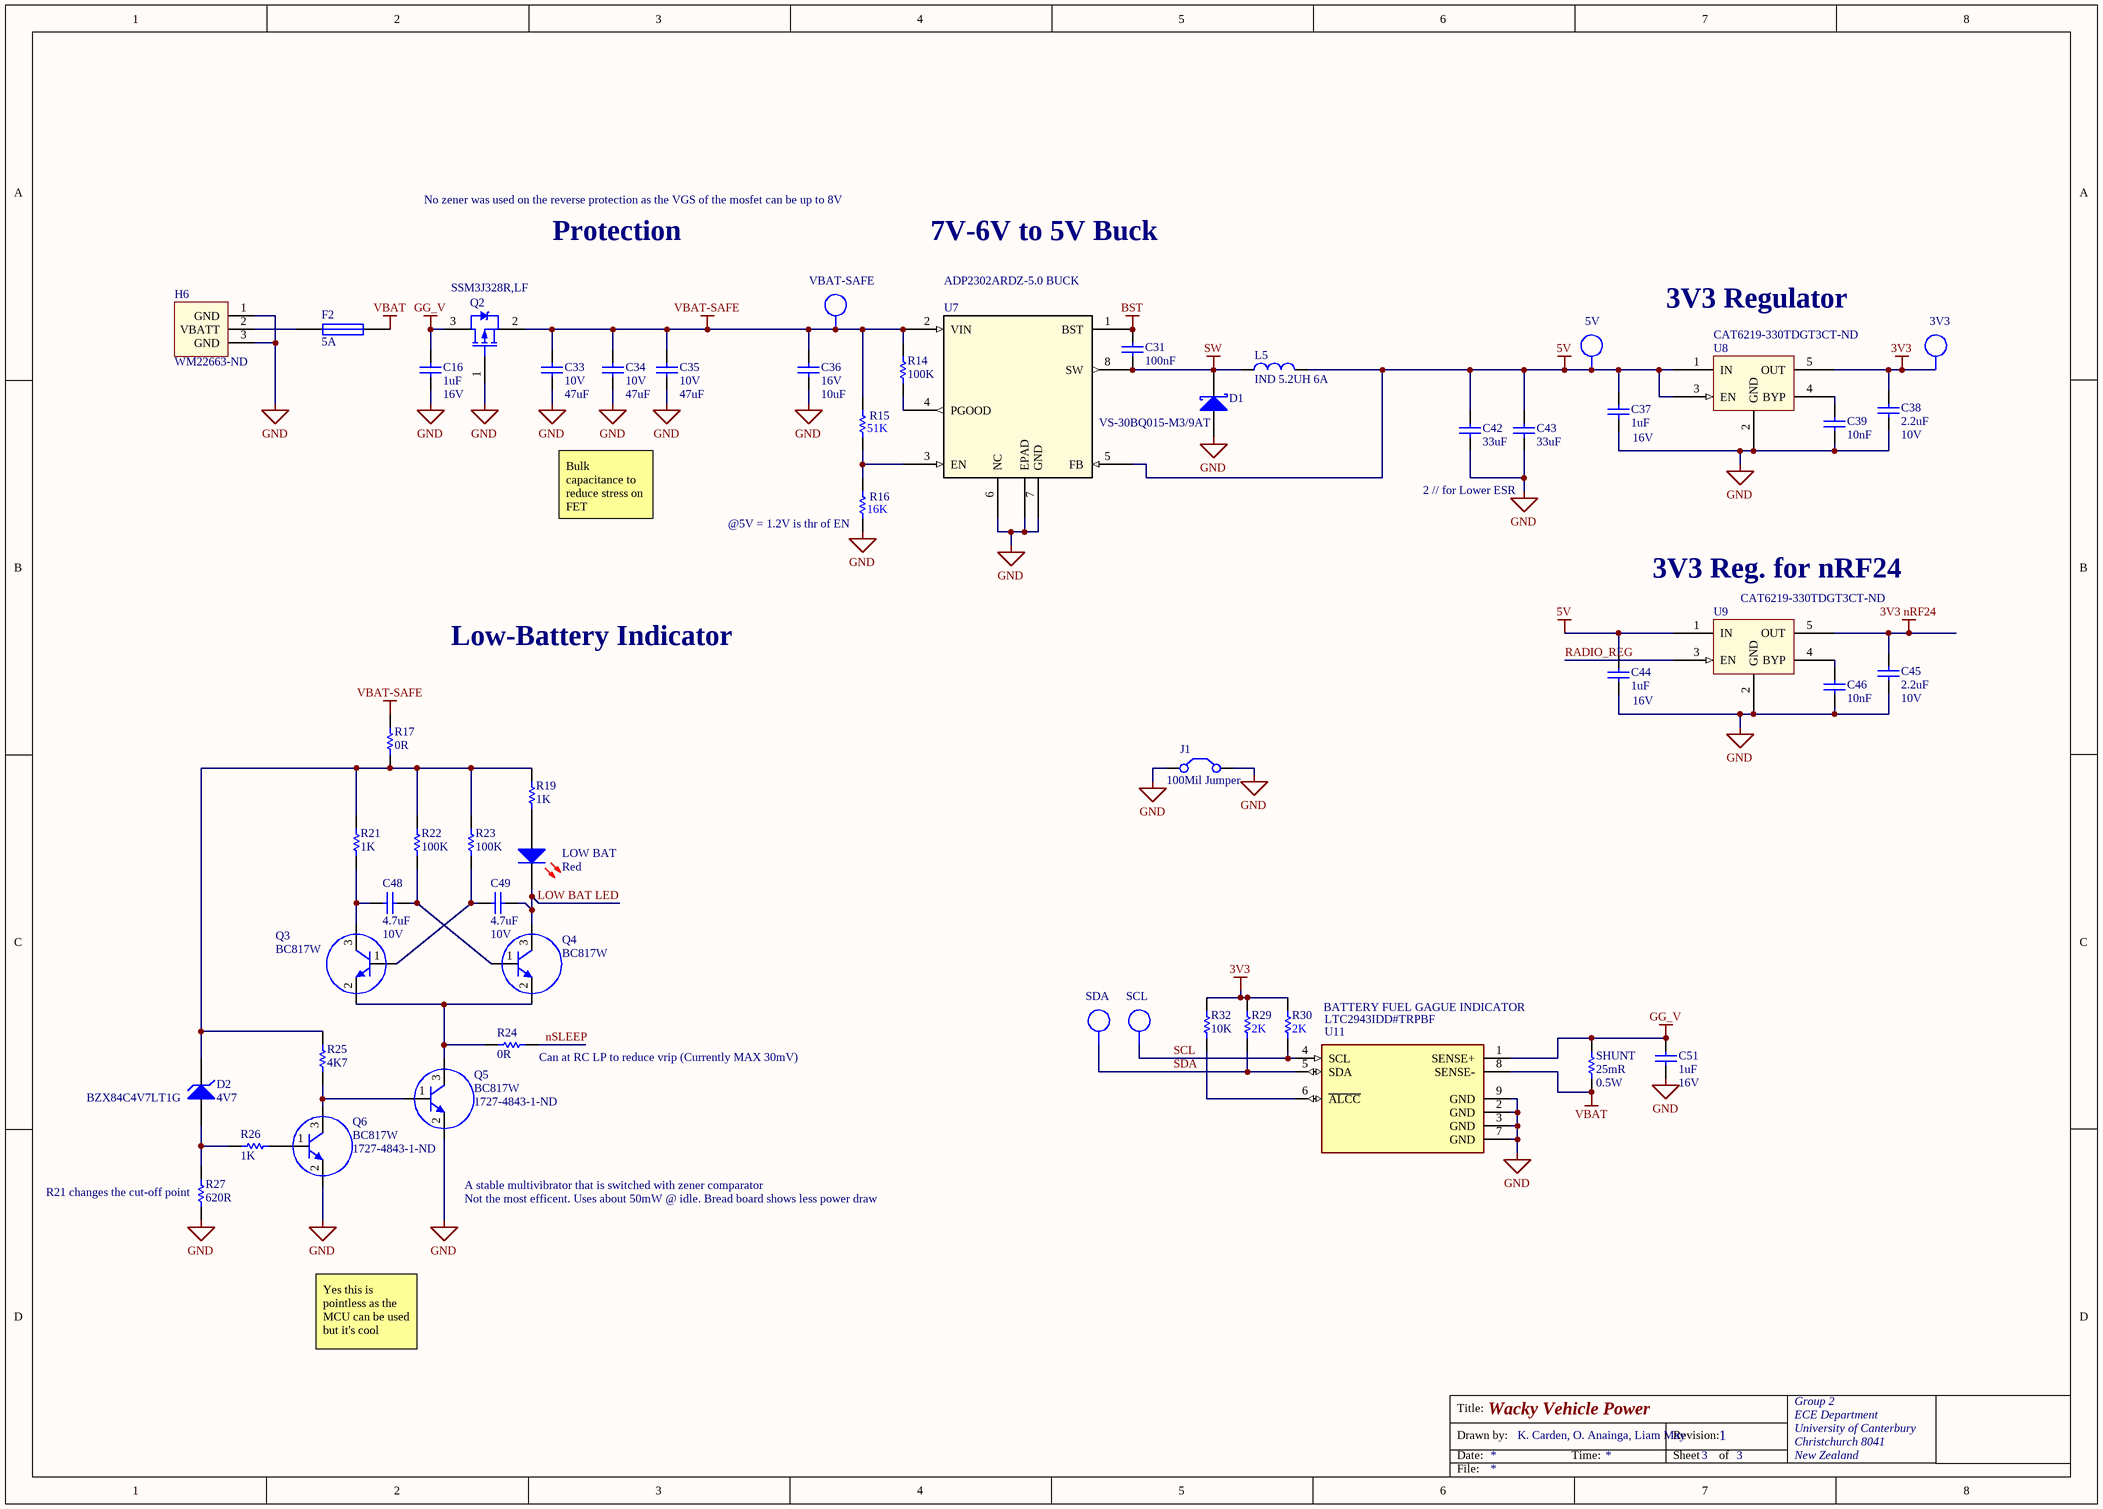
[diagram p2: Car_Power.SchDoc]

### Parts
(Parts that share a designator on the sheet are numbered #1, #2 ... from top to bottom, then left to right.)
3V3#2  TP  [TP_1206]  (value not drawn)  (no BOM)
5V  TP  [TP_1206]  (value not drawn)  (no BOM)
C16  Max Voltage: 16V  [CAPC1608L]  (hidden comment: 1uF)
C31  100nF  [CAPC1608L]
C33  Max Voltage: 10V  [CAPC3216L]  (hidden comment: 47uF)
C34  Max Voltage: 10V  [CAPC3216L]  (hidden comment: 47uF)
C35  Max Voltage: 10V  [CAPC3216L]  (hidden comment: 47uF)
C36  Voltage - Rated: 16V  [CAPC2012L]  (hidden comment: 10uF)
C37  Max Voltage: 16V  [CAPC1608L]  (hidden comment: 1uF)
C38  Max Voltage: 10V  [CAPC1608L]  (hidden comment: 2.2uF)
C39  10nF  [CAPC1608L]
C42  33uF  [CAPC2012L]
C43  33uF  [CAPC2012L]
C44  Max Voltage: 16V  [CAPC1608L]  (hidden comment: 1uF)
C45  Max Voltage: 10V  [CAPC1608L]  (hidden comment: 2.2uF)
C46  10nF  [CAPC1608L]
C48  Max Voltage: 10V  [CAPC1608N]  (hidden comment: 4.7uF)
C49  Max Voltage: 10V  [CAPC1608N]  (hidden comment: 4.7uF)
C51  Max Voltage: 16V  [CAPC1608L]  (hidden comment: 1uF)
D1  VS-30BQ015-M3/9AT  [SMC]
D2  4V7  Manufacturer Part Number: BZX84C4V7LT1G  [SOT23_L]
F2  5A  [RESC3216N]
H6  Supplier Part Number 1: WM22663-ND  [BATT_HEADER_3POS]  (hidden comment: Battery_HEADER_3pin)
J1  100Mil Jumper  [JMP2.54]
L5  IND 5.2UH 6A  [INDUCTOR5u2]
LOW_BAT  Red  [WL-SMCW0603]
Q2  SSM3J328R,LF  [SOT23_L]
Q3  BC817W  [SOT323_M]
Q4  BC817W  [SOT323_M]
Q5  Supplier Part Number 2: 1727-4843-1-ND  [SOT323_M]  (hidden comment: BC817W)
Q6  Supplier Part Number 2: 1727-4843-1-ND  [SOT323_M]  (hidden comment: BC817W)
R14  100K  [RESC1608L]
R15  51K  [RESC1608L]
R16  16K  [RESC1608L]
R17  0R  [RESC1608L]
R19  1K  [RESC1608L]
R21  1K  [RESC1608L]
R22  100K  [RESC1608L]
R23  100K  [RESC1608L]
R24  0R  [RESC1608L]
R25  4K7  [RESC1608L]
R26  1K  [RESC1608L]
R27  620R  [RESC1608L]
R29  2K  [RESC1608L]
R30  2K  [RESC1608L]
R32  10K  [RESC1608L]
SCL  TWI_CLK  [TP_1206]  (value not drawn)  (no BOM)
SDA  TWI_DATA  [TP_1206]  (value not drawn)  (no BOM)
SHUNT  25mR  Power: 0.5W  [RESC3216N]
U7  ADP2302ARDZ-5.0 BUCK  [RD_8_1]
U8  Supplier Part Number: CAT6219-330TDGT3CT-ND  [SOT95P280X145-5N]  (hidden comment: CAT6219-330TDGT3)
U9  Supplier Part Number: CAT6219-330TDGT3CT-ND  [SOT95P280X145-5N]  (hidden comment: CAT6219-330TDGT3)
U11  LTC2943IDD#TRPBF  [FP-DD-8-05-08-1698-IPC_B]
VBAT-SAFE  TP  [TP_1206]  (value not drawn)  (no BOM)

### Nets
3V3: 3V3#2.1 C38.2 R29.2 R30.2 R32.1 U8.5(OUT)
3V3 nRF24: C45.2 U9.5(OUT)
5V: 5V.1 C37.2 C42.2 C43.2 C44.2 L5.2 U7.5(FB) U8.1(IN) U8.3(EN) U9.1(IN)
BST: C31.2 U7.1(BST)
GG_V: C16.2 C51.1 Q2.3 SHUNT.2 U11.1(SENSE+)
GND: C16.1 C33.1 C34.1 C35.1 C36.1 C37.1 C38.1 C39.1 C42.1 C43.1 C44.1 C45.1 C46.1 C51.2 D1.1(A) H6.1(GND) H6.3(GND) J1.1(C1) J1.2(C2) Q2.1 Q5.2 Q6.2 R16.1 R27.1 U7.6(NC) U7.7(GND) U7.EPAD U8.2(GND) U9.2(GND) U11.2(GND) U11.3(GND) U11.7(GND) U11.9(GND)
SW: C31.1 D1.2(K) L5.1 U7.8(SW)
VBAT: F2.2 SHUNT.1 U11.8(SENSE-)
VBAT-SAFE: C33.2 C34.2 C35.2 C36.2 Q2.2 R14.2 R15.2 R17.2 U7.2(VIN) VBAT-SAFE.1
LOW BAT LED: C49.2 LOW_BAT.1(K) Q4.3
nSLEEP: R24.1
RADIO_REG: U9.3(EN)
SCL: R30.1 SCL.1 U11.4(SCL)
SDA: R29.1 SDA.1 U11.5(SDA)
NetC39_2: C39.2 U8.4(BYP)
NetC46_2: C46.2 U9.4(BYP)
NetC48_1: C48.1 Q3.3 R21.1
NetC48_2: C48.2 Q4.1 R22.1
NetC49_1: C49.1 Q3.1 R23.1
NetD2_1: D2.1(A) R26.2 R27.2
NetD2_3: D2.3(K) R17.1 R19.2 R21.2 R22.2 R23.2 R25.2
NetF2_1: F2.1 H6.2(VBATT)
NetLOW_BAT_2: LOW_BAT.2(A) R19.1
NetQ3_2: Q3.2 Q4.2 Q5.3 R24.2
NetQ5_1: Q5.1 Q6.3 R25.1
NetQ6_1: Q6.1 R26.1
NetR14_1: R14.1 U7.4(PGOOD)
NetR15_1: R15.1 R16.2 U7.3(EN)
NetR32_2: R32.2 U11.6(~{ALCC})

### Notes on the sheet
- No zener was used on the reverse protection as the VGS of the mosfet can be up to 8V
- Protection
- 7V-6V to 5V Buck
- 3V3 Regulator
- Bulk capacitance to reduce stress on FET
- 2 // for Lower ESR
- (near R16) @5V = 1.2V is thr of EN
- (near U9) 3V3 Reg. for nRF24
- Low-Battery Indicator
- BATTERY FUEL GAGUE INDICATOR
- (near R24) Can at RC LP to reduce vrip (Currently MAX 30mV)
- A stable multivibrator that is switched with zener comparator
- (near R27) R21 changes the cut-off point
- Not the most efficent. Uses about 50mW @ idle. Bread board shows less power draw
- Yes this is pointless as the MCU can be used but it's cool
- Title:
- Drawn by:
- Date:
- Time:
- Revision:
- Sheet
- of
- File:

### Library data of the parts
3V3#2 5V VBAT-SAFE = TP_1206: Test-Point 3.3x1.6x2.1mm SMD; Manufacturer: Harwin Inc; Manufacturer Part Number: S1751-46R; Manufacturer PN: *; Storage Location: ProtoPlace; Mounting Type: Surface Mount; Type: PC Test Point; Supplier 1: Digi-Key; Supplier Part Number 1: 952-1478-2-ND; Supplier 2: Farnell; Supplier Part Number 2: 1826282; Supplier: ECE Dept; Value: TP
C16 C37 C44 C51 = CC_1uF_0603: CAP CER 1uF Y5V -20% +80% 16V 0603; PackageReference: 0603; Code_IPC: 1608 [0603]; Verify: *; Supplier: ECE Dept; Storage Location: PCB Assembly WS; Value: 1uF
C31 = CC_100nF_0603: CAP CER 100nF X7R +-10% 50V 0603; PackageReference: 0603; Code_IPC: 1608 [0603]; Verify: *; Supplier: ECE Dept; Storage Location: PCB Assembly WS; Value: 100nF
C33-C35 = CC_47uF_1206: CAP CER 47uF X5R -/+20% 10V 1206; Verify: *; Supplier: ECE Dept; Storage Location: PCB Assembly WS; Dielectric: X5R; Footprint: 1210 (3225 metric); MoV: 10V; Value: 47uF
C36 = CC_10uF_0805_16V: as C5#2 on sheet Car_Peripherals; PackageReference: 0805; Code_IPC: 2012[0805]; Supplier 1: Digi-Key; RoHS: RoHS Compliant; Category: Capacitors; Stock 1: 20000; Pricing 1: 1=0.35, 10=0.25, 100=0.1178, 500=0.08254, 1000=0.06831 (NZD); Packaging: Cut Tape (CT); Part Status: Active; Temperature Coefficient: X5R; Operating Temperature: -55°C ~ 85°C; Features: -; Ratings: -; Applications: General Purpose; Mounting Type: Surface Mount, MLCC; Package / Case: 0805 (2012 Metric); Size / Dimension: 0.079" L x 0.049" W (2.00mm x 1.25mm); Height - Seated (Max): -; Thickness (Max): 0.055" (1.40mm); Lead Spacing: -; Lead Style: -; ComponentLink1URL: http://www.samsungsem.com/kr/support/product-search/mlcc/CL21A106KOQNNWE.jsp; ComponentLink1Description: http://www.samsungsem.com/kr/support/product-search/mlcc/CL21A106KOQNNWE.jsp; Supplier Part Number 1: 1276-2894-1-ND; Value: 10uF
C38 C45 = CC_2.2uF_0603: CAP CER 2.2uF X5R +-20% 10V 0603; PackageReference: 0603; Code_IPC: 1608 [0603]; Verify: *; Supplier: ECE Dept; Storage Location: PCB Assembly WS; Value: 2.2uF
C39 C46 = CC_10nF_0603: CAP CER 10nF X7R +-10% 50V 0603; PackageReference: 0603; Code_IPC: 1608 [0603]; Verify: *; Supplier: ECE Dept; Storage Location: PCB Assembly WS; Value: 10nF
C42 C43 = CC_33uF_6V3_0805: CAP CER 33uF X5R 6V3 0805; Manufacturer: TDK Corporation; Manufacturer Part Number: C2012X5R0J336M125AC; Tolerance: ±20%; Voltage - Rated: 6.3V; Notification: Current market demand for these product types have resulted in fluctuating and extending lead times. Lead times may differ.; Supplier 1: Digi-Key; RoHS: RoHS Compliant; Category: Capacitors; Stock 1: 20000; Pricing 1: 1=1.65, 10=1.262, 100=0.9023, 500=0.6985, 1000=0.60149 (NZD); Packaging: Cut Tape (CT); Part Status: Active; Temperature Coefficient: X5R; Operating Temperature: -55°C ~ 85°C; Features: Low ESL; Ratings: -; Applications: General Purpose; Failure Rate: -; Mounting Type: Surface Mount, MLCC; Package / Case: 0805 (2012 Metric); Size / Dimension: 0.079" L x 0.049" W (2.00mm x 1.25mm); Height - Seated (Max): -; Thickness (Max): 0.057" (1.45mm); Lead Spacing: -; Lead Style: -; ComponentLink1URL: https://product.tdk.com/info/en/catalog/datasheets/mlcc_commercial_general_en.pdf; ComponentLink1Description: https://product.tdk.com/info/en/catalog/datasheets/mlcc_commercial_general_en.pdf; Supplier Part Number 1: 445-5986-1-ND; Value: 33uF
C48 C49 = CC_4.7uF_0603: as C12#1 on sheet Car_MCU; PackageReference: 0805; Code_IPC: 2012[0805]; Verify: *; Supplier: ECE Dept; Storage Location: PCB Assembly WS; Value: 4.7uF
D1 = DS_VS-30BQ015-M3: DIODE, SCHOTTKY, 3A, 15V, DO-214AB / SMC; Manufacturer: Vishay Semiconductors; Forward Voltage: 350mV; Max Forward Surge Current (Ifsm): 650A; Peak Reverse Current: 4mA; Average Rectified Current: 3A; Max Reverse Voltage (DC): 15V; Supplier: Digi-Key; ComponentLink1URL: https://datasheet.ciiva.com/36181/vs-30bq015-m3-9at-36181258.pdf; ComponentLink1Description: https://datasheet.ciiva.com/36181/vs-30bq015-m3-9at-36181258.pdf; Supplier 1: Digi-Key; Supplier 2: Element14; Supplier Part Number 1: VS-30BQ015-M3/9ATGIDKR-ND; Supplier Part Number 2: 2628288; Supplier Part Number: VS-30BQ015-M3/9AT-ND; Manufacturer Part Number: VS-30BQ015-M3/9AT
D2 = DZ_4.7V: BZX84C4V7LT1G - DIODE, ZENER, 4.7V, 225MW, SOT23; Manufacturer: ON SEMICONDUCTOR; Breakdown Voltage Max: 5; Breakover Voltage Min: 4.7; Diode Case Style: SOT-23; Power Dissipation Pd: 225; Supplier 1: Farnell; Supplier 2: Digi-Key; Supplier Part Number 1: 1459051; Supplier Part Number 2: BZX84C4V7LT1GOSCT-ND
F2 = FS_Fuse_5.0A: Fuse 5.0A Fast Acting 1206 SMD; Manufacturer Part Number: C1F5; Manufacturer: Bel TRP; Voltage Rating (AC): 125V; Voltage Rating (DC): 63V; DC Cold Resistance: 19mR; Fuse Type: Board Mount (Cartridge Style Excluded); Approvals: CE,cURus; Mount: Surface Mount; Case/Package: 1206; Number of Pins: 2; Case Code (Metric): 3216; Case Code (Imperial): 1206; Contact Plating: Nickel,Tin; Min Operating Temperature: -55°C; Max Operating Temperature: 125°C; Packaging: Tape and Reel; Voltage Rating: 125V; Length: 0.126inch; Width: 0.062inch; Supplier 1: Digi-Key; Stock 1: 725; Pricing 1: 1=0.32, 5=0.312, 10=0.298, 50=0.2662, 100=0.2479, 250=0.22032, 500=0.1836, 1000=0.17442 (USD); ComponentLink1URL: http://www.farnell.com/datasheets/2571625.pdf; ComponentLink1Description: http://www.farnell.com/datasheets/2571625.pdf; ComponentLink2URL: http://belfuse.com/pdfs/C1F.pdf; ComponentLink2Description: http://belfuse.com/pdfs/C1F.pdf; ComponentLink3URL: http://www.mouser.com/ds/2/643/C1F-594910.pdf; ComponentLink3Description: http://www.mouser.com/ds/2/643/C1F-594910.pdf; ComponentLink4URL: https://belfuse.com/resources/StewartConnector/C1F.pdf; ComponentLink4Description: https://belfuse.com/resources/StewartConnector/C1F.pdf; Current Rating: 5A; Supplier Part Number 1: 507-1886-1-ND; Supplier 2: Element14; Supplier Part Number 2: 2848595; Value: 5A
H6 = Battery_HEADER_3pin: 3Pin Header 2.54mm spacing / Digikey #WM22663-ND; Supplier 1: Digi-Key
J1 = TP_JUMPER: 2.54mm Jumper Thru Hole; Pitch Spacing: 2.54; No. of Rows: 1; No. of Positions: 2; Supplier: ECE Dept; Supplier 1: Farnell; Supplier Part Number 1: 1097975; Storage Location: ECE$ Store
L5 = CDRH104RNP-5R2NC: FIXED IND 5.2UH 6A 22 MOHM SMD; Manufacturer: Sumida America Components Inc.; Material - Core: Ferrite; Tolerance: ±30%; Current - Saturation: 5.6A; Shielding: Shielded; DC Resistance (DCR): 22 mOhm Max; Supplier 1: Digi-Key; Manufacturer Part Number: CDRH104RNP-5R2NC; RoHS: RoHS Compliant; Category: Inductors, Coils, Chokes; Stock 1: 3849; Pricing 1: 1=2.9, 10=2.678, 100=1.8743, 500=1.5173 (NZD); Packaging: Cut Tape (CT); Part Status: Active; Type: -; Q @ Freq: -; Frequency - Self Resonant: -; Ratings: -; Operating Temperature: -40°C ~ 100°C; Mounting Type: Surface Mount; Package / Case: Nonstandard; Supplier Device Package: -; Size / Dimension: 0.402" L x 0.394" W (10.20mm x 10.00mm); Height - Seated (Max): 0.157" (4.00mm); ComponentLink1URL: http://products.sumida.com/products/pdf/CDRH104R.pdf; ComponentLink1Description: http://products.sumida.com/products/pdf/CDRH104R.pdf; Supplier Part Number 1: 308-2280-1-ND
LOW_BAT = DL_150060RS75000: as STAT0 on sheet Car_MCU; LED Mounting: SMD; Supplier 1: Farnell; Supplier Part Number 1: 2322071; Manufacturer Part Number: 150060RS75000; Storage Location: PCB Assembly WS; Supplier: ECE Dept; LED Colour: Red
Q2 = TM_SSM3J328R: MOSFET P-CH 20V 6A SOT23-3; Manufacturer: Toshiba; FET Feature: Logic Level Gate, 1.5V Drive; FET Type: MOSFET P-Channel, Metal Oxide; Gate Charge (Qg) @ Vgs: 12.8nC @ 4.5V; Input Capacitance (Ciss) @ Vds: 840pF @ 10V; Power - Max: 1W; Rds On Max: 29.8mR; Drain to Source Resistance: 47.4mR; Turn-On Delay Time: 32ns; Power Dissipation: 2W; Number of Channels: 1; Turn-Off Delay Time: 107ns; Gate to Source Voltage (Vgs): 8V; Input Capacitance: 840pF; Element Configuration: Single; Drain to Source Breakdown Voltage: -20V; Vgs(th) (Max) @ Id: 1V @ 1mA; Current - Continuous Drain (Id) @ 25° C: 6A; Drain to Source Voltage (Vdss): 20V; Package / Case: SOT-23-3 Flat Leads; Supplier Device Package: SOT-23F; Pricing: 1=0.79, 10=0.658, 25=0.5772, 100=0.4939, 250=0.42836, 500=0.36284, 1000=0.27972 (NZD); Storage Location: PCB Assembly WS; Supplier: Digi-Key; ComponentLink1URL: https://datasheet.ciiva.com/11158/ssm3j328r-datasheet-en-20140301-11158652.pdf; ComponentLink1Description: https://datasheet.ciiva.com/11158/ssm3j328r-datasheet-en-20140301-11158652.pdf; Supplier Part Number: SSM3J328RLFDKR-ND; Max Operating Temperature: 150°C; Mount: Surface Mount; Packaging: Tape and Reel; Min Operating Temperature: -55°C; Continuous Drain Current (ID): 6A; Radiation Hardening: No; Max Power Dissipation: 1W; Package Quantity: 3000; Case/Package: SOT-23-3; Number of Pins: 3; Number of Elements: 1; Supplier 1: Digi-Key; Supplier Part Number 1: SSM3J328RLFDKR-ND; Manufacturer Part Number: SSM3J328R,LF
Q3-Q6 = TB_BC817W: as Q1 on sheet Car_Peripherals; Supplier 1: Farnell; Supplier Part Number 1: 2114873; Manufacturer PN: BC817W; Storage Location: PCB Assembly WS; Supplier: ECE Dept; Supplier 2: Digi-Key; Value: BC817W
  Q3 Q4: Supplier Part Number 2: 1727-4843-1-ND
R14 R22 R23 = RS_100K: RES 100K OHM 1/10W 5% 0603 SMD; Storage Location: PCB Assembly WS; Supplier: ECE Dept; Value: 100K
R15 = RS_51K: RES 51.0K OHM 1/10W 5% 0603 SMD; Storage Location: PCB Assembly WS; Supplier: ECE Dept; Value: 51K
R16 = RS_16K: RES 16K OHM 1/10W 5% 0603 SMD; Storage Location: PCB Assembly WS; Supplier: ECE Dept; Value: 16K
R17 R24 = RS_0R0: RES 0.0 OHM 1/10W 5% 0603 SMD; Storage Location: PCB Assembly WS; Supplier: ECE Dept; Value: 0R
R19 R21 R26 = RS_1K: RES 1.0K OHM 1/10W 5% 0603 SMD; Storage Location: PCB Assembly WS; Supplier: ECE Dept; Value: 1K
R25 = RS_4K7: RES 4.7K OHM 1/10W 5% 0603 SMD; Storage Location: PCB Assembly WS; Supplier: ECE Dept; Value: 4K7
R27 = RS_620R: RES 620 OHM 1/10W 5% 0603 SMD; Storage Location: PCB Assembly WS; Supplier: ECE Dept; Value: 620R
R29 R30 = RS_2K: RES 2K OHM 1/10W 5% 0603 SMD; Storage Location: PCB Assembly WS; Supplier: ECE Dept; Value: 2K
R32 = RS_10K: RES 10.0K OHM 1/10W 5% 0603 SMD; Storage Location: PCB Assembly WS; Supplier: ECE Dept; Value: 10K
SCL SDA = TP_1206: as VCORE on sheet Car_MCU; Manufacturer PN: *; Storage Location: ProtoPlace; Mounting Type: Surface Mount; Type: PC Test Point; Supplier 1: Digi-Key; Supplier Part Number 1: 952-1478-2-ND; Supplier 2: Farnell; Supplier Part Number 2: 1826282; Supplier: ECE Dept
SHUNT = RS_25mR: 0.5W 1206 25mR Resistor
U7 = ADP2302ARDZ-5.0-R7: IC REG BUCK 5V 2A 8SOIC; Vendor: Analog Devices Inc; Frequency - Switching: 700kHz; Output Type: Fixed; Voltage - Input (Max): 20V; Manufacturer_Part_Number: ADP2302ARDZ-5.0-R7; Type: DEV; Value: Value; Supplier 1: Digi-Key; Current - Output: 2A; Voltage - Output (Min/Fixed): 5V; Supplier Part Number 1: ADP2302ARDZ-5.0-R7CT-ND; ComponentLink1Description: ADP2302ARDZ-5.0 Datasheet; ComponentLink1URL: \\maxwell\elecapp\AltiumDesigner\Libraries\DatasheetsNew\ENCE461\ADP2302_2303.pdf
U8 U9 = SV_CAT6219-330TDGT3: IC REG LIN 3.3V 500MA TSOT23-5; Voltage - Input (Max): 5.5V; Voltage Dropout (Max): 0.5V @ 500mA; Manufacturer Part Number: CAT6219-330TDGT3; Base Part Number: CAT6219; Current - Output: 500mA; Package / Case: SOT-23-5 Thin, TSOT-23-5; Supplier: Digi-Key; Supplier Device Package: TSOT-23-5; Voltage - Output (Min/Fixed): 3.3V; ComponentLink1URL: http://www.onsemi.com/pub/Collateral/CAT6219-D.PDF; ComponentLink1Description: http://www.onsemi.com/pub/Collateral/CAT6219-D.PDF; Supplier 1: Digi-Key; ComponentLink2Description: CAT6219 Datasheet; ComponentLink2URL: \\maxwell\elecapp\AltiumDesigner\Libraries\DatasheetsNew\ENCE461\CAT6219-D.PDF
U11 = CMP-09132-000025-1: IC BATT MONITOR MULTI-CHEM 8DFN; Interface: I2C; Case/Package: DFN; Packaging: Tape and Reel; Number of Pins: 8; Max Operating Temperature: 85°C; RoHS Compliant: Yes; Min Operating Temperature: -40°C

## Nets that join several sheets
3V3: Car_MCU (16 pins), Car_Peripherals (10 pins), Car_Power (6 pins)
3V3 nRF24: Car_Peripherals (L1.1), Car_Power (C45.2 U9.5)
5V: Car_Peripherals (13 pins), Car_Power (10 pins)
GND: Car_MCU (26 pins), Car_Peripherals (35 pins), Car_Power (33 pins)
VBAT-SAFE: Car_Peripherals (Buzzer1.1 F1.1 R1#2.2), Car_Power (10 pins)
AIN1: Car_MCU (U1#1.44), Car_Peripherals (U1#2.16)
AIN2: Car_MCU (U1#1.47), Car_Peripherals (U1#2.15)
BIN1: Car_MCU (U1#1.9), Car_Peripherals (U1#2.9)
BIN2: Car_MCU (U1#1.48), Car_Peripherals (U1#2.10)
BUMPER_SIGNAL: Car_MCU (U1#1.52), Car_Peripherals (Bumper2.1)
CH1: Car_MCU (U1#1.29), Car_Peripherals (CH_Select1.4)
CH2: Car_MCU (U1#1.30), Car_Peripherals (CH_Select1.3)
CS: Car_MCU (U1#1.28), Car_Peripherals (U4.4)
IR SIG: Car_MCU (U1#1.4), Car_Peripherals (IR1.2)
LED_STRIP: Car_MCU (U1#1.34), Car_Peripherals (U5.4)
MISO: Car_MCU (U1#1.27), Car_Peripherals (MISO1.1 U4.7)
MOSI: Car_MCU (U1#1.22), Car_Peripherals (MOSI1.1 U4.6)
nFAULT: Car_MCU (U1#1.38), Car_Peripherals (nFAULT1.1 R3#2.2 U1#2.8)
nRF24_CE: Car_MCU (U1#1.25), Car_Peripherals (U4.3)
nRF24_IRQ: Car_MCU (U1#1.20), Car_Peripherals (U4.8)
nSLEEP: Car_MCU (U1#1.37), Car_Peripherals (U1#2.1), Car_Power (R24.1)
PA18: Car_MCU (U1#1.13), Car_Peripherals (Spare1.3)
PA20: Car_MCU (U1#1.16), Car_Peripherals (Spare1.2)
PA22: Car_MCU (U1#1.14), Car_Peripherals (Spare1.4)
PA23: Car_MCU (U1#1.15), Car_Peripherals (Spare1.1)
PIEZO_BUZ: Car_MCU (U1#1.49), Car_Peripherals (R2#2.1)
RADIO_REG: Car_MCU (U1#1.26), Car_Power (U9.3)
SCL: Car_MCU (U1#1.36), Car_Power (R30.1 SCL.1 U11.4)
SDA: Car_MCU (U1#1.43), Car_Power (R29.1 SDA.1 U11.5)
SERVO_SIGNAL_1: Car_MCU (U1#1.33), Car_Peripherals (U2.4)
SERVO_SIGNAL_2: Car_MCU (U1#1.32), Car_Peripherals (U3.4)
SPCK: Car_MCU (U1#1.21), Car_Peripherals (SCK1.1 U4.5)